# EAGLE schematic CFT-PB2 (EAGLE 5.11)
DRAWN_BY: Alexios; PROJECT_NAME: CFT Mini-Computer; REVISION: Rev B; SHEET_DESCRIPTION: Address Register, Address Bus Drivers & Termination, Autoindex Logic, Device Decoder; SIMULATION_FILENAME: addressing.v; URL: http://www.bedroomlan.org/cft

## Sheet 1 of 6
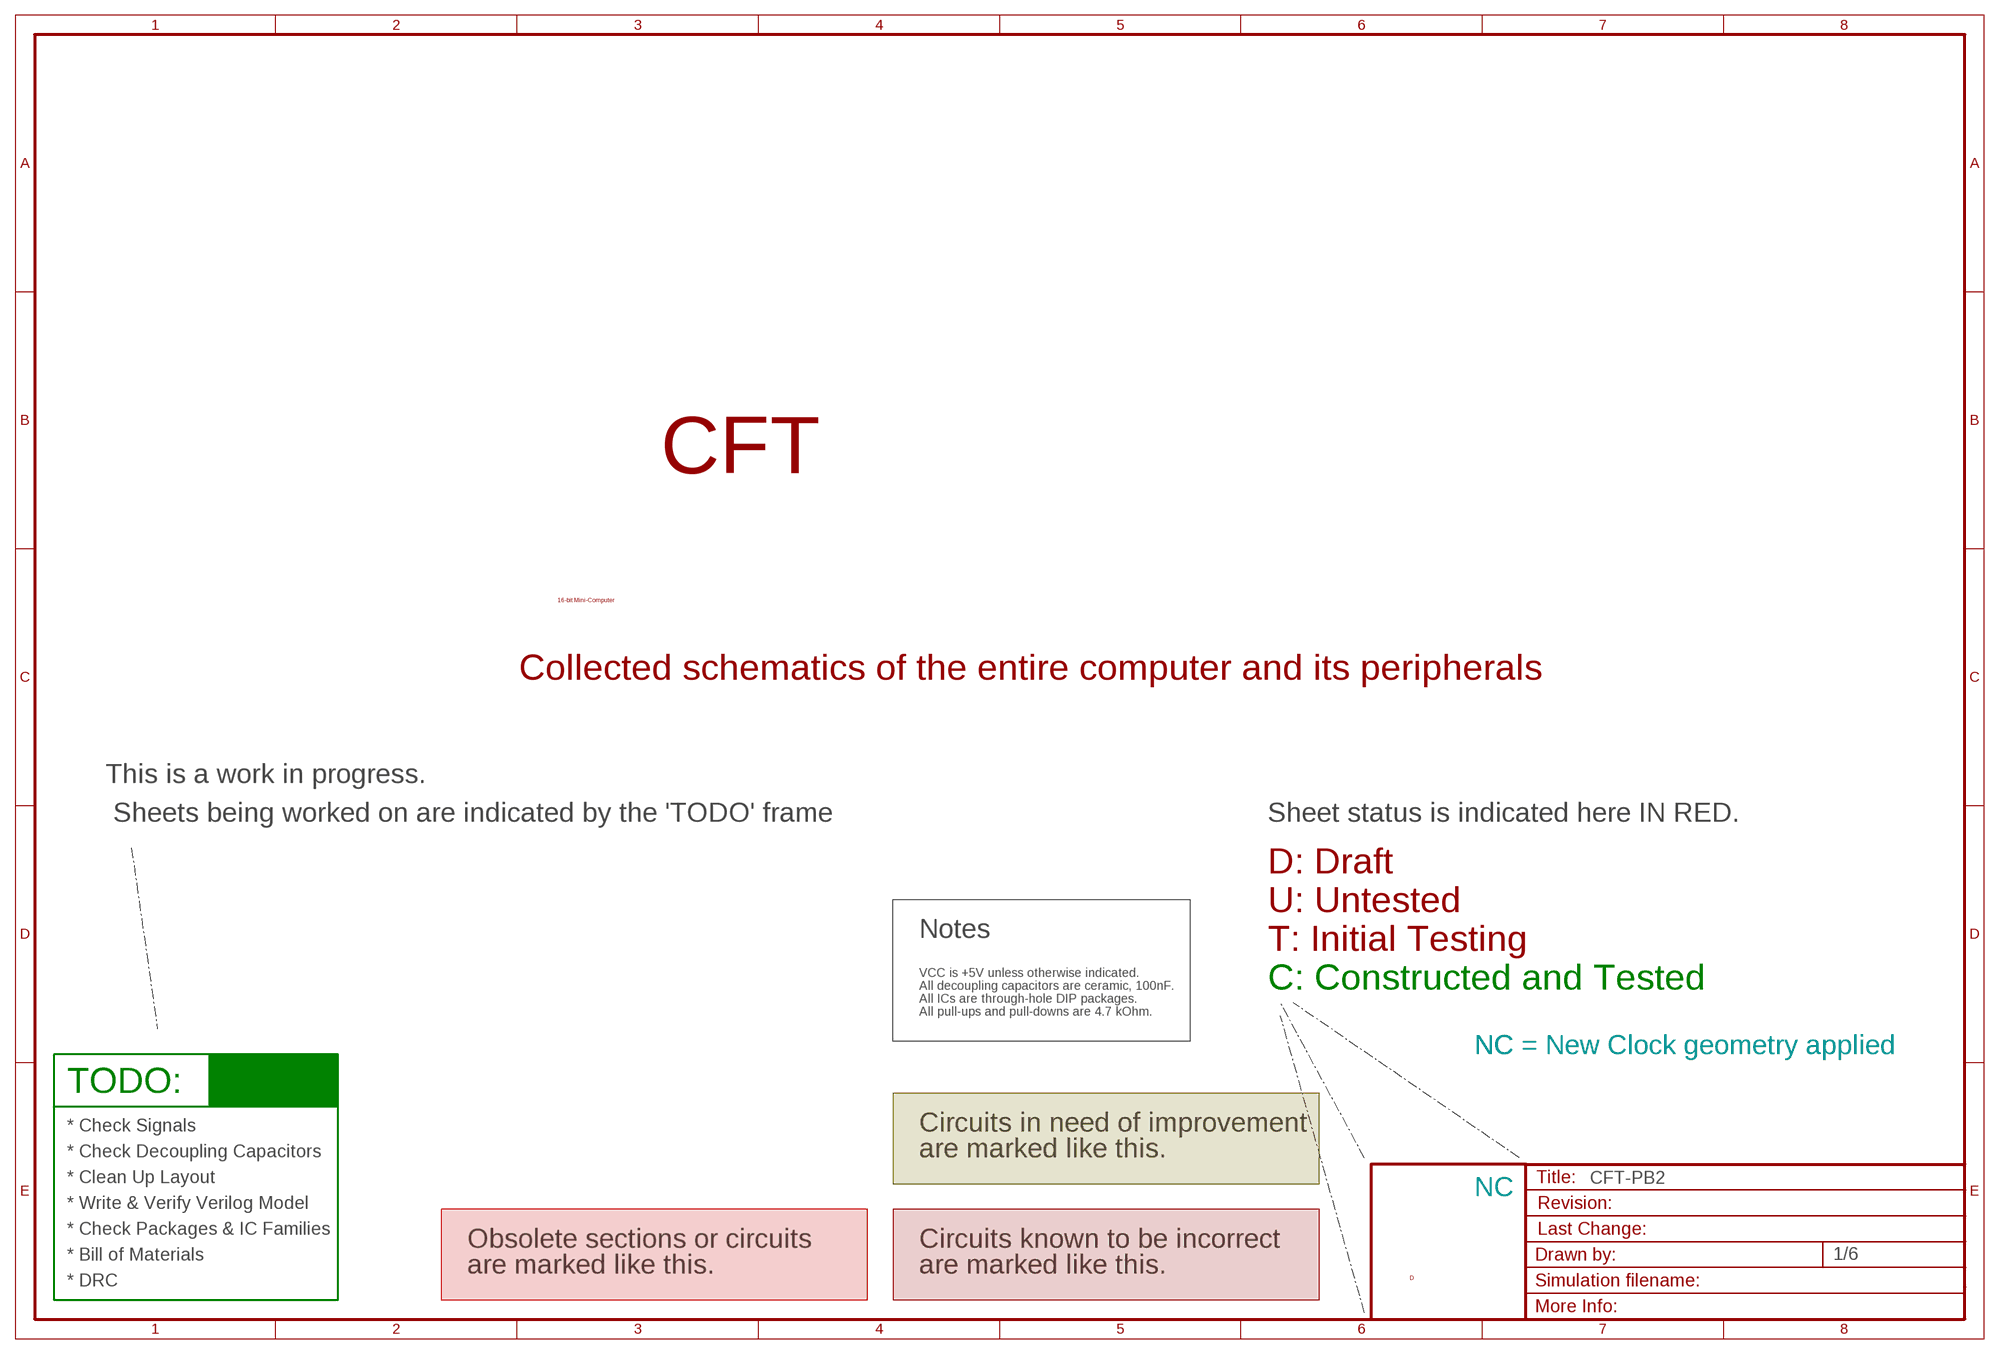
[diagram p0: schematic, sheet 1]

### Notes on the sheet
- CFT
- 16-bit Mini-Computer
- Collected schematics of the entire computer and its peripherals
- This is a work in progress.
- Sheets being worked on are indicated by the 'TODO' frame | Sheet status is indicated here IN RED.
- D: Draft
- U: Untested
- Notes
- T: Initial Testing
- VCC is +5V unless otherwise indicated.
- All decoupling capacitors are ceramic, 100nF. | C: Constructed and Tested
- All ICs are through-hole DIP packages.
- All pull-ups and pull-downs are 4.7 kOhm.
- NC | NC = New Clock geometry applied
- TODO:
- * Check Signals | Circuits in need of improvement
- * Check Decoupling Capacitors | are marked like this.
- * Clean Up Layout
- NC
- * Write & Verify Verilog Model
- * Check Packages & IC Families
- Obsolete sections or circuits | Circuits known to be incorrect
- * Bill of Materials
- are marked like this. | are marked like this.
- D
- * DRC

## Sheet 2 of 6
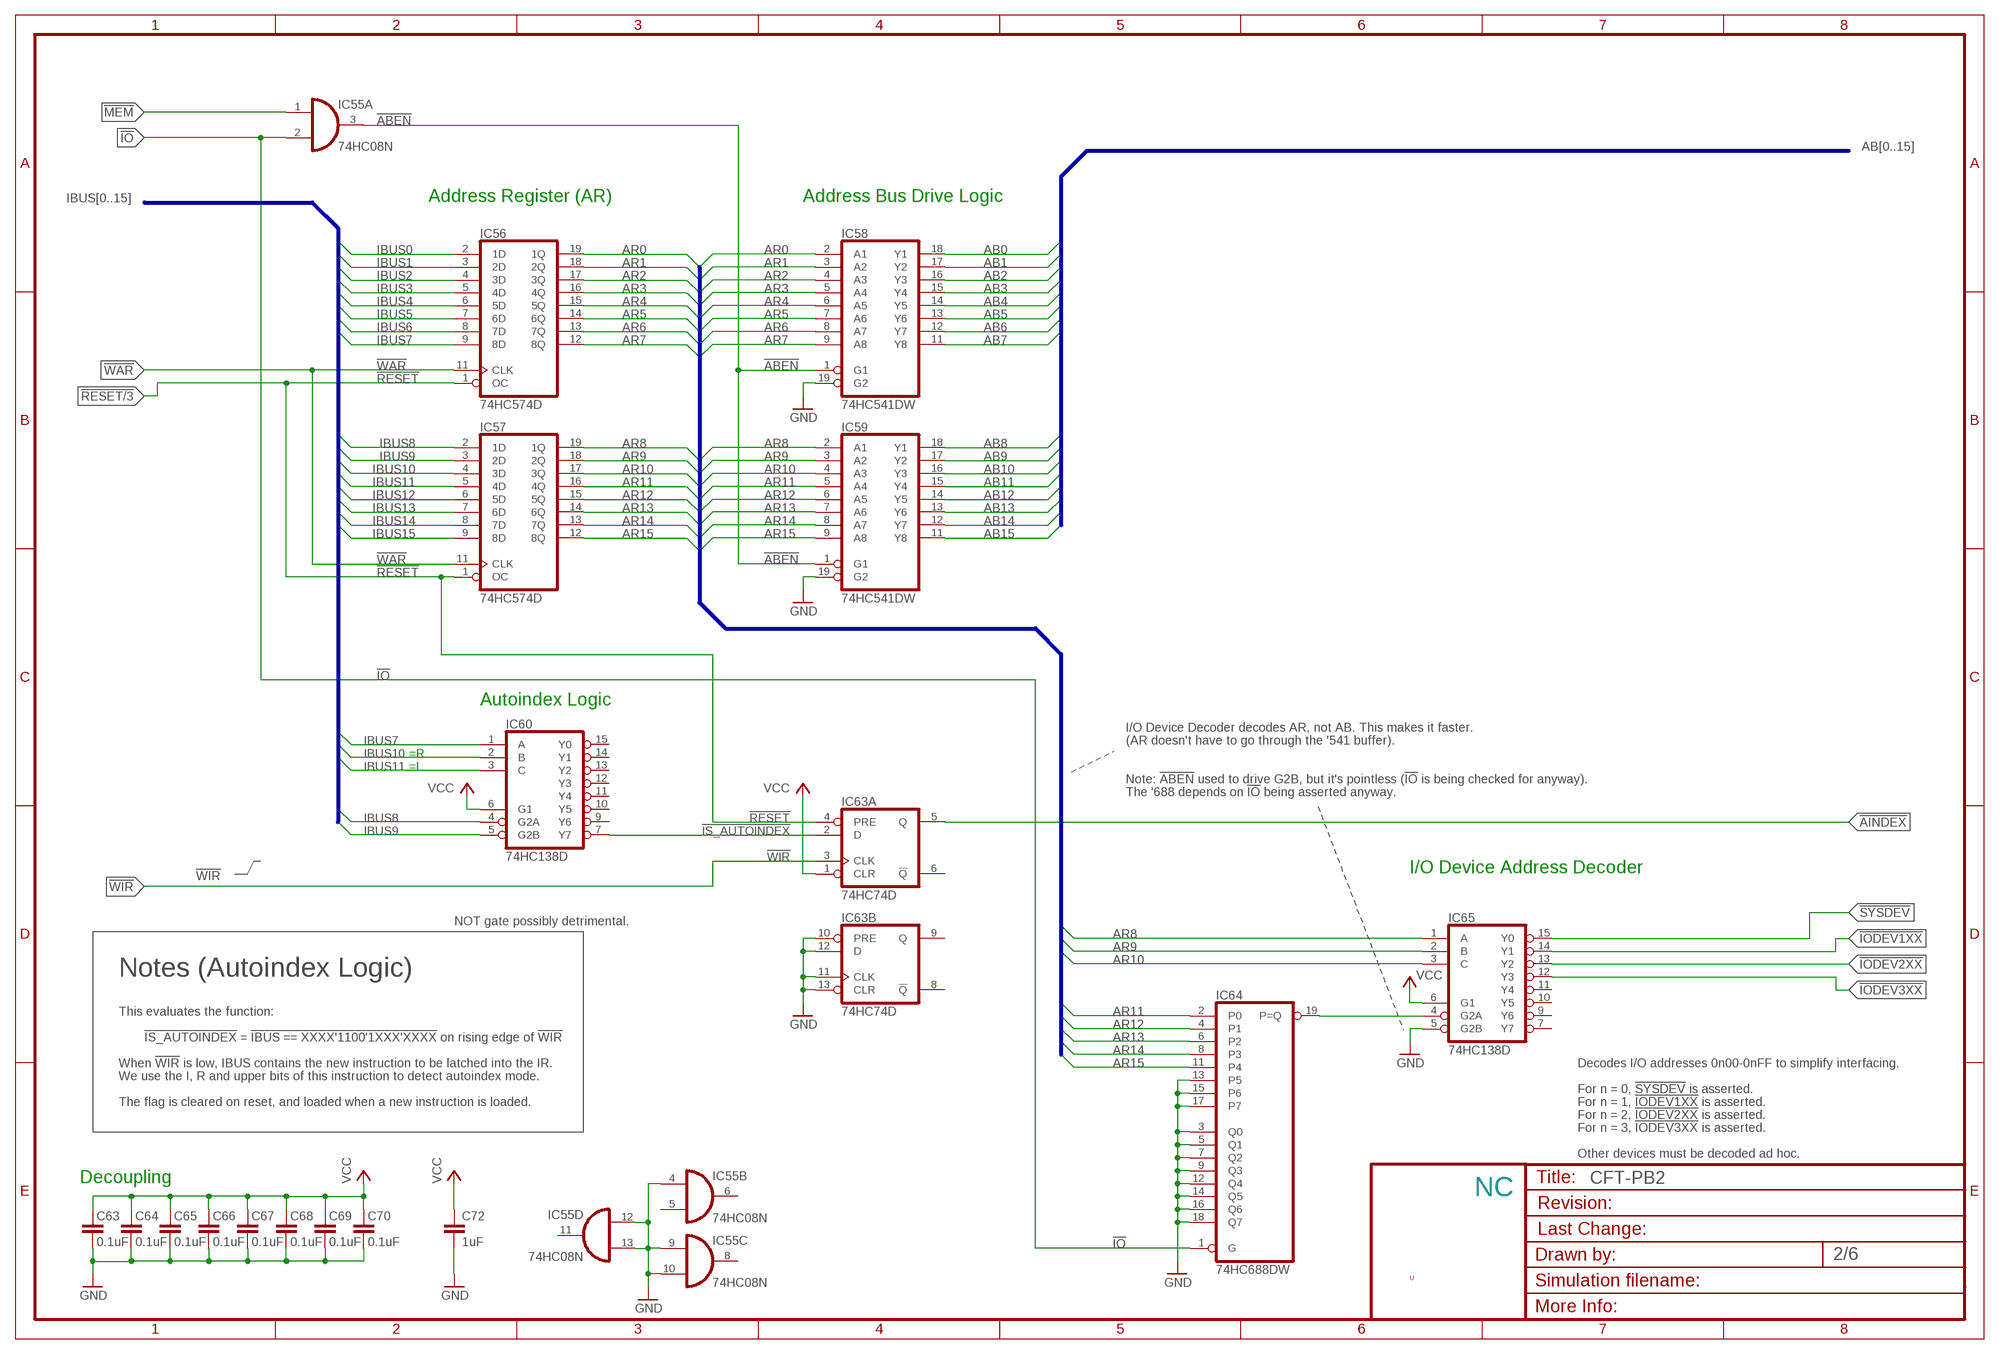
[diagram p1: schematic, sheet 2]

### Parts
C63  0.1uF  C-EUC0805K  [C0805K]
C64  0.1uF  C-EUC0805K  [C0805K]
C65  0.1uF  C-EUC0805K  [C0805K]
C66  0.1uF  C-EUC0805K  [C0805K]
C67  0.1uF  C-EUC0805K  [C0805K]
C68  0.1uF  C-EUC0805K  [C0805K]
C69  0.1uF  C-EUC0805K  [C0805K]
C70  0.1uF  C-EUC0805K  [C0805K]
C72  1uF  C-EUC0805K  [C0805K]
IC55  74HC08N  [DIL14]
IC56  74HC574D  [SO20W]
IC57  74HC574D  [SO20W]
IC58  74HC541DW  [SO20W]
IC59  74HC541DW  [SO20W]
IC60  74HC138D  [SO16]
IC63  74HC74D  [SO14]
IC64  74HC688DW  [SO20W]
IC65  74HC138D  [SO16]

### Nets
!ABEN: IC55.3(A:O) IC58.1(G1) IC59.1(G1)
!AINDEX: IC63.5(A:Q) ; also sheet 6
!IO: IC55.2(A:I1) IC64.1(G) ; also sheet 6
!IODEV1XX: IC65.14(Y1) ; also sheet 6
!IODEV2XX: IC65.13(Y2) ; also sheet 6
!IODEV3XX: IC65.12(Y3) ; also sheet 6
!IS_AUTOINDEX: IC60.7(Y7) IC63.2(A:D)
!MEM: IC55.1(A:I0) ; also sheet 6
!RESET: IC56.1(OC) IC57.1(OC) IC63.4(A:PRE) ; also sheet 3,6
!SYSDEV: IC65.15(Y0) ; also sheet 6
!WAR: IC56.11(CLK) IC57.11(CLK) ; also sheet 6
!WIR: IC63.3(A:CLK) ; also sheet 6
AB0: IC58.18(Y1) ; also sheet 6
AB1: IC58.17(Y2) ; also sheet 6
AB2: IC58.16(Y3) ; also sheet 6
AB3: IC58.15(Y4) ; also sheet 6
AB4: IC58.14(Y5) ; also sheet 6
AB5: IC58.13(Y6) ; also sheet 6
AB6: IC58.12(Y7) ; also sheet 6
AB7: IC58.11(Y8) ; also sheet 6
AB8: IC59.18(Y1) ; also sheet 6
AB9: IC59.17(Y2) ; also sheet 6
AB10: IC59.16(Y3) ; also sheet 6
AB11: IC59.15(Y4) ; also sheet 6
AB12: IC59.14(Y5) ; also sheet 6
AB13: IC59.13(Y6) ; also sheet 6
AB14: IC59.12(Y7) ; also sheet 6
AB15: IC59.11(Y8) ; also sheet 6
AR0: IC56.19(1Q) IC58.2(A1)
AR1: IC56.18(2Q) IC58.3(A2)
AR2: IC56.17(3Q) IC58.4(A3)
AR3: IC56.16(4Q) IC58.5(A4)
AR4: IC56.15(5Q) IC58.6(A5)
AR5: IC56.14(6Q) IC58.7(A6)
AR6: IC56.13(7Q) IC58.8(A7)
AR7: IC56.12(8Q) IC58.9(A8)
AR8: IC57.19(1Q) IC59.2(A1) IC65.1(A)
AR9: IC57.18(2Q) IC59.3(A2) IC65.2(B)
AR10: IC57.17(3Q) IC59.4(A3) IC65.3(C)
AR11: IC57.16(4Q) IC59.5(A4) IC64.2(P0)
AR12: IC57.15(5Q) IC59.6(A5) IC64.4(P1)
AR13: IC57.14(6Q) IC59.7(A6) IC64.6(P2)
AR14: IC57.13(7Q) IC59.8(A7) IC64.8(P3)
AR15: IC57.12(8Q) IC59.9(A8) IC64.11(P4)
GND [low power]: C63.1 C64.1 C65.1 C66.1 C67.1 C68.1 C69.1 C70.1 C72.2 IC55.4(B:I0) IC55.9(C:I0) IC55.10(C:I1) IC55.12(D:I0) IC55.13(D:I1) IC58.19(G2) IC59.19(G2) IC63.10(B:PRE) IC63.11(B:CLK) IC63.12(B:D) IC63.13(B:CLR) IC64.3(Q0) IC64.5(Q1) IC64.7(Q2) IC64.9(Q3) IC64.12(Q4) IC64.13(P5) IC64.14(Q5) IC64.15(P6) IC64.16(Q6) IC64.17(P7) IC64.18(Q7) IC65.5(G2B) ; also sheet 3,4,5,6
IBUS0: IC56.2(1D) ; also sheet 3,4,5,6
IBUS1: IC56.3(2D) ; also sheet 3,4,5,6
IBUS2: IC56.4(3D) ; also sheet 3,4,5,6
IBUS3: IC56.5(4D) ; also sheet 3,4,5,6
IBUS4: IC56.6(5D) ; also sheet 3,4,5,6
IBUS5: IC56.7(6D) ; also sheet 3,4,5,6
IBUS6: IC56.8(7D) ; also sheet 3,4,5,6
IBUS7: IC56.9(8D) IC60.1(A) ; also sheet 3,4,5,6
IBUS8: IC57.2(1D) IC60.4(G2A) ; also sheet 3,4,5,6
IBUS9: IC57.3(2D) IC60.5(G2B) ; also sheet 3,4,5,6
IBUS10: IC57.4(3D) IC60.2(B) ; also sheet 3,4,5,6
IBUS11: IC57.5(4D) IC60.3(C) ; also sheet 3,4,5,6
IBUS12: IC57.6(5D) ; also sheet 3,4,5,6
IBUS13: IC57.7(6D) ; also sheet 3,4,5,6
IBUS14: IC57.8(7D) ; also sheet 3,4,5,6
IBUS15: IC57.9(8D) ; also sheet 3,4,5,6
N$95: IC64.19(P=Q) IC65.4(G2A)
VCC [low power]: C63.2 C64.2 C65.2 C66.2 C67.2 C68.2 C69.2 C70.2 C72.1 IC60.6(G1) IC63.1(A:CLR) IC65.6(G1) ; also sheet 3,4,5,6
Unconnected: IC55.5(B:I1) IC55.6(B:O) IC55.8(C:O) IC55.11(D:O) IC60.9(Y6) IC60.10(Y5) IC60.11(Y4) IC60.12(Y3) IC60.13(Y2) IC60.14(Y1) IC60.15(Y0) IC63.6(A:!Q) IC63.8(B:!Q) IC63.9(B:Q) IC65.7(Y7) IC65.9(Y6) IC65.10(Y5) IC65.11(Y4)

### Buses
AR[0..15]
IBUS[0..15]
AB[0..15]

### Notes on the sheet
- Address Register (AR) | Address Bus Drive Logic
- Autoindex Logic
- I/O Device Decoder decodes AR, not AB. This makes it faster.
- (AR doesn't have to go through the '541 buffer).
- =R
- =I
- Note: !ABEN! used to drive G2B, but it's pointless (!IO! is being checked for anyway).
- The '688 depends on !IO! being asserted anyway.
- I/O Device Address Decoder
- NOT gate possibly detrimental.
- Notes (Autoindex Logic)
- This evaluates the function:
- !IS_AUTOINDEX! = !IBUS == XXXX'1100'1XXX'XXXX! on rising edge of !WIR!
- When !WIR! is low, IBUS contains the new instruction to be latched into the IR. | Decodes I/O addresses 0n00-0nFF to simplify interfacing.
- We use the I, R and upper bits of this instruction to detect autoindex mode.
- For n = 0, !SYSDEV! is asserted.
- The flag is cleared on reset, and loaded when a new instruction is loaded. | For n = 1, !IODEV1XX! is asserted.
- For n = 2, !IODEV2XX! is asserted.
- For n = 3, !IODEV3XX! is asserted.
- Other devices must be decoded ad hoc.
- Decoupling
- NC
- U

## Sheet 3 of 6
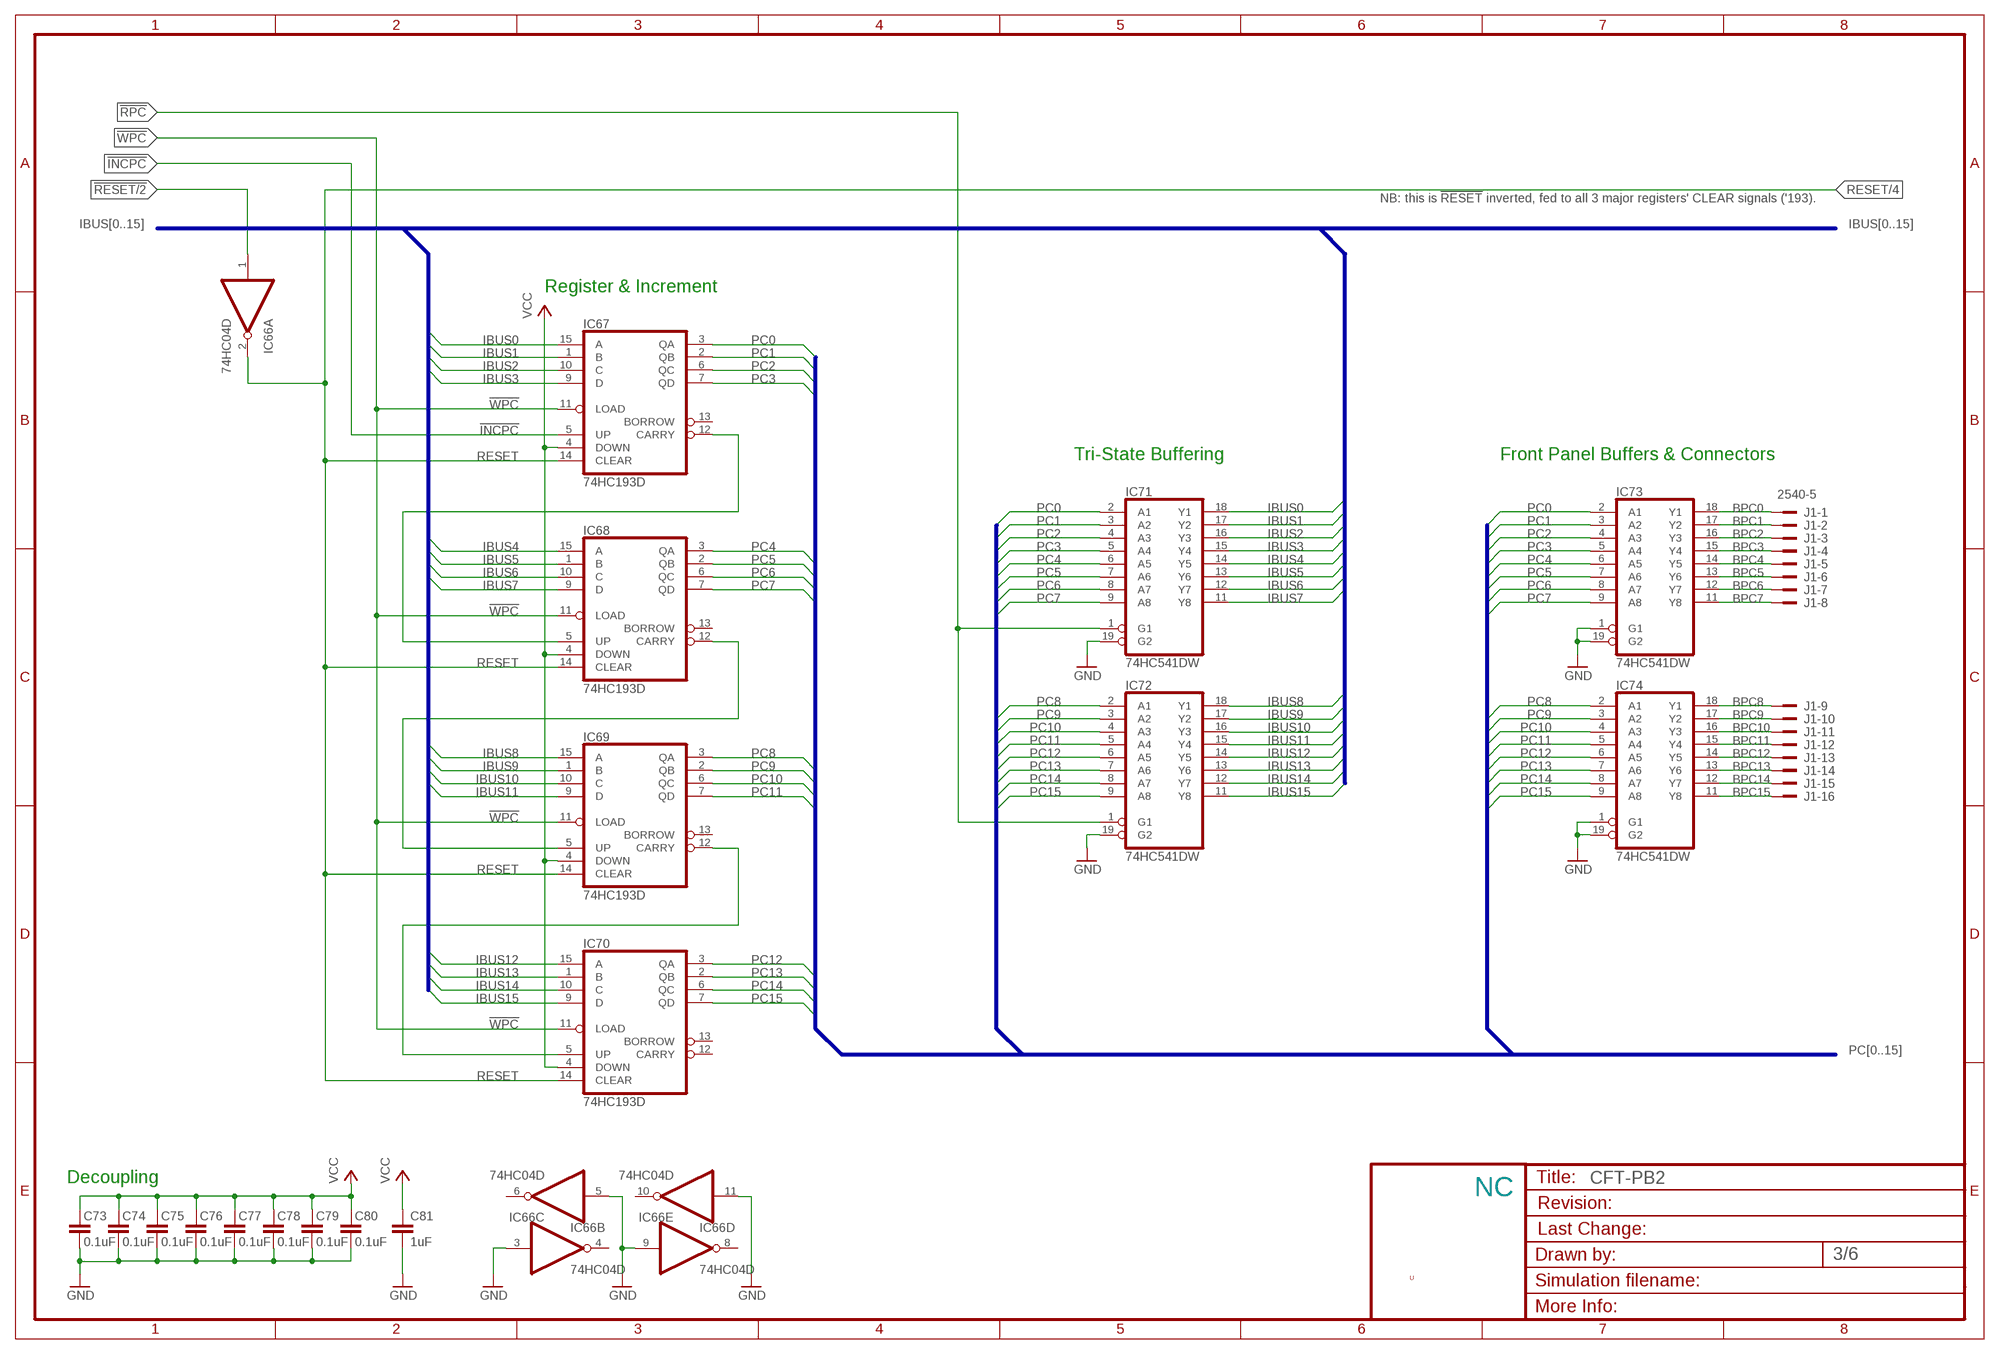
[diagram p2: schematic, sheet 3]

### Parts
C73  0.1uF  C-EUC0805K  [C0805K]
C74  0.1uF  C-EUC0805K  [C0805K]
C75  0.1uF  C-EUC0805K  [C0805K]
C76  0.1uF  C-EUC0805K  [C0805K]
C77  0.1uF  C-EUC0805K  [C0805K]
C78  0.1uF  C-EUC0805K  [C0805K]
C79  0.1uF  C-EUC0805K  [C0805K]
C80  0.1uF  C-EU025-024X044  [C025-024X044]
C81  1uF  C-EU025-024X044  [C025-024X044]
IC66  74HC04D  [SO14]
IC67  74HC193D  [SO16D]
IC68  74HC193D  [SO16D]
IC69  74HC193D  [SO16D]
IC70  74HC193D  [SO16D]
IC71  74HC541DW  [SO20W]
IC72  74HC541DW  [SO20W]
IC73  74HC541DW  [SO20W]
IC74  74HC541DW  [SO20W]
J1  2540-5  [PAK100/2500-5-40]

### Nets
!INCPC: IC67.5(UP) ; also sheet 6
!RESET: IC66.1(A:I) ; also sheet 2,6
!RPC: IC71.1(G1) IC72.1(G1) ; also sheet 6
!WPC: IC67.11(LOAD) IC68.11(LOAD) IC69.11(LOAD) IC70.11(LOAD) ; also sheet 6
BPC0: IC73.18(Y1) J1.1
BPC1: IC73.17(Y2) J1.2
BPC2: IC73.16(Y3) J1.3
BPC3: IC73.15(Y4) J1.4
BPC4: IC73.14(Y5) J1.5
BPC5: IC73.13(Y6) J1.6
BPC6: IC73.12(Y7) J1.7
BPC7: IC73.11(Y8) J1.8
BPC8: IC74.18(Y1) J1.9
BPC9: IC74.17(Y2) J1.10
BPC10: IC74.16(Y3) J1.11
BPC11: IC74.15(Y4) J1.12
BPC12: IC74.14(Y5) J1.13
BPC13: IC74.13(Y6) J1.14
BPC14: IC74.12(Y7) J1.15
BPC15: IC74.11(Y8) J1.16
GND [low power]: C73.1 C74.1 C75.1 C76.1 C77.1 C78.1 C79.1 C80.1 C81.2 IC66.3(B:I) IC66.5(C:I) IC66.9(D:I) IC66.11(E:I) IC71.19(G2) IC72.19(G2) IC73.1(G1) IC73.19(G2) IC74.1(G1) IC74.19(G2) ; also sheet 2,4,5,6
IBUS0: IC67.15(A) IC71.18(Y1) ; also sheet 2,4,5,6
IBUS1: IC67.1(B) IC71.17(Y2) ; also sheet 2,4,5,6
IBUS2: IC67.10(C) IC71.16(Y3) ; also sheet 2,4,5,6
IBUS3: IC67.9(D) IC71.15(Y4) ; also sheet 2,4,5,6
IBUS4: IC68.15(A) IC71.14(Y5) ; also sheet 2,4,5,6
IBUS5: IC68.1(B) IC71.13(Y6) ; also sheet 2,4,5,6
IBUS6: IC68.10(C) IC71.12(Y7) ; also sheet 2,4,5,6
IBUS7: IC68.9(D) IC71.11(Y8) ; also sheet 2,4,5,6
IBUS8: IC69.15(A) IC72.18(Y1) ; also sheet 2,4,5,6
IBUS9: IC69.1(B) IC72.17(Y2) ; also sheet 2,4,5,6
IBUS10: IC69.10(C) IC72.16(Y3) ; also sheet 2,4,5,6
IBUS11: IC69.9(D) IC72.15(Y4) ; also sheet 2,4,5,6
IBUS12: IC70.15(A) IC72.14(Y5) ; also sheet 2,4,5,6
IBUS13: IC70.1(B) IC72.13(Y6) ; also sheet 2,4,5,6
IBUS14: IC70.10(C) IC72.12(Y7) ; also sheet 2,4,5,6
IBUS15: IC70.9(D) IC72.11(Y8) ; also sheet 2,4,5,6
N$70: IC67.12(CARRY) IC68.5(UP)
N$71: IC68.12(CARRY) IC69.5(UP)
N$734: IC69.12(CARRY) IC70.5(UP)
PC0: IC67.3(QA) IC71.2(A1) IC73.2(A1)
PC1: IC67.2(QB) IC71.3(A2) IC73.3(A2)
PC2: IC67.6(QC) IC71.4(A3) IC73.4(A3)
PC3: IC67.7(QD) IC71.5(A4) IC73.5(A4)
PC4: IC68.3(QA) IC71.6(A5) IC73.6(A5)
PC5: IC68.2(QB) IC71.7(A6) IC73.7(A6)
PC6: IC68.6(QC) IC71.8(A7) IC73.8(A7)
PC7: IC68.7(QD) IC71.9(A8) IC73.9(A8)
PC8: IC69.3(QA) IC72.2(A1) IC74.2(A1)
PC9: IC69.2(QB) IC72.3(A2) IC74.3(A2)
PC10: IC69.6(QC) IC72.4(A3) IC74.4(A3) ; also sheet 6
PC11: IC69.7(QD) IC72.5(A4) IC74.5(A4) ; also sheet 6
PC12: IC70.3(QA) IC72.6(A5) IC74.6(A5) ; also sheet 6
PC13: IC70.2(QB) IC72.7(A6) IC74.7(A6) ; also sheet 6
PC14: IC70.6(QC) IC72.8(A7) IC74.8(A7) ; also sheet 6
PC15: IC70.7(QD) IC72.9(A8) IC74.9(A8) ; also sheet 6
RESET: IC66.2(A:O) IC67.14(CLEAR) IC68.14(CLEAR) IC69.14(CLEAR) IC70.14(CLEAR) ; also sheet 4,5
VCC [low power]: C73.2 C74.2 C75.2 C76.2 C77.2 C78.2 C79.2 C80.2 C81.1 IC67.4(DOWN) IC68.4(DOWN) IC69.4(DOWN) IC70.4(DOWN) ; also sheet 2,4,5,6
Unconnected: IC66.4(B:O) IC66.6(C:O) IC66.8(D:O) IC66.10(E:O) IC67.13(BORROW) IC68.13(BORROW) IC69.13(BORROW) IC70.12(CARRY) IC70.13(BORROW)

### Buses
IBUS[0..15]
PC[0..15]

### Notes on the sheet
- NB: this is !RESET! inverted, fed to all 3 major registers' CLEAR signals ('193).
- Register & Increment
- Tri-State Buffering | Front Panel Buffers & Connectors
- Decoupling
- NC
- U

## Sheet 4 of 6
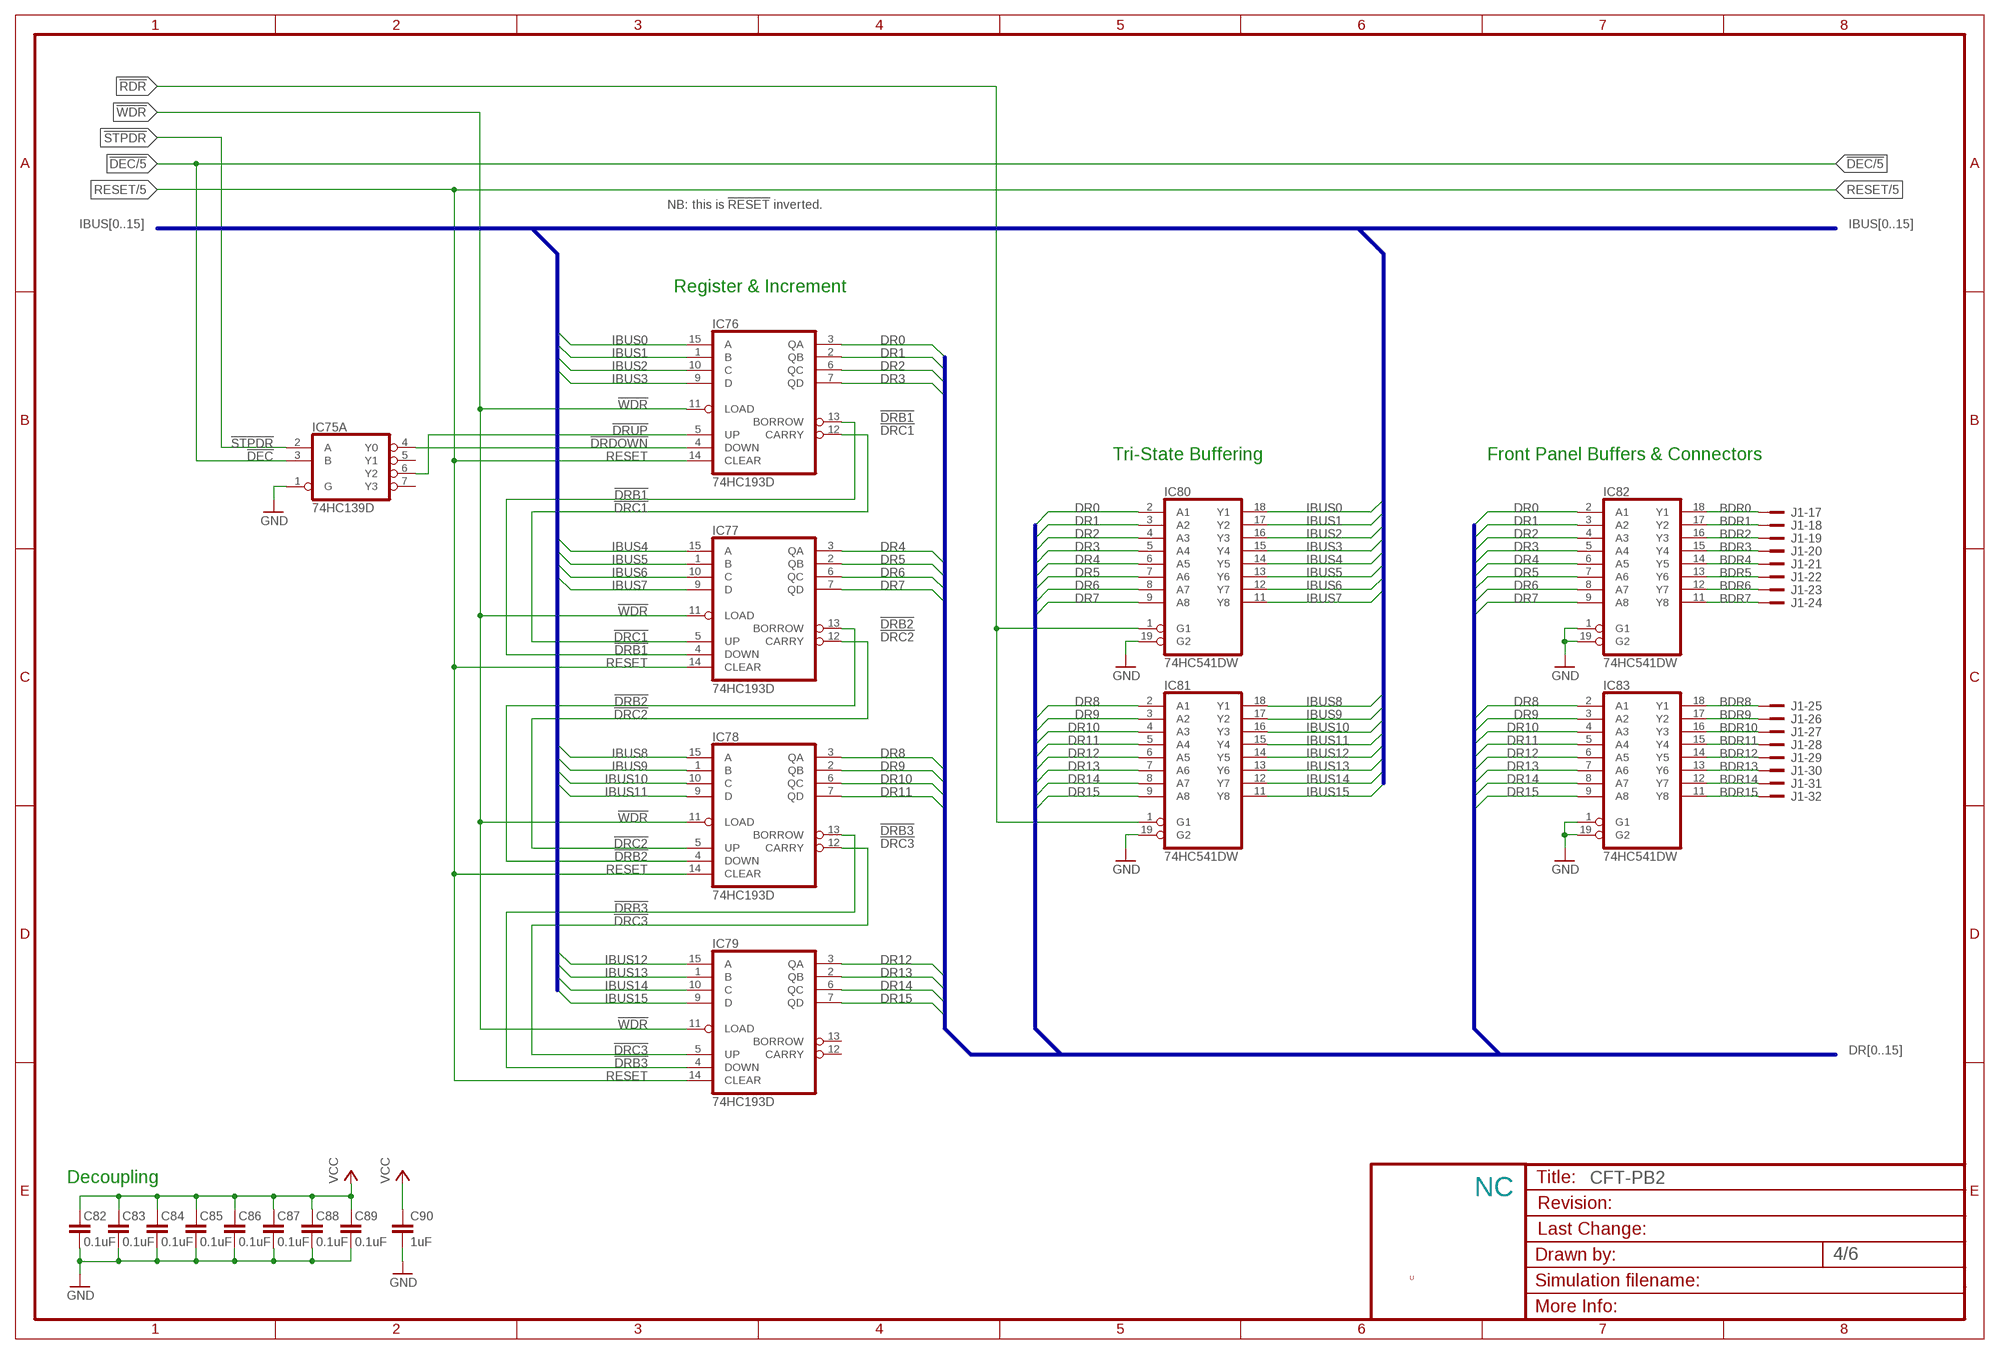
[diagram p3: schematic, sheet 4]

### Parts
C82  0.1uF  C-EU025-024X044  [C025-024X044]
C83  0.1uF  C-EU025-024X044  [C025-024X044]
C84  0.1uF  C-EU025-024X044  [C025-024X044]
C85  0.1uF  C-EU025-024X044  [C025-024X044]
C86  0.1uF  C-EU025-024X044  [C025-024X044]
C87  0.1uF  C-EU025-024X044  [C025-024X044]
C88  0.1uF  C-EU025-024X044  [C025-024X044]
C89  0.1uF  C-EU025-024X044  [C025-024X044]
C90  1uF  C-EU025-024X044  [C025-024X044]
IC75  74HC139D  [SO16]
IC76  74HC193D  [SO16D]
IC77  74HC193D  [SO16D]
IC78  74HC193D  [SO16D]
IC79  74HC193D  [SO16D]
IC80  74HC541DW  [SO20W]
IC81  74HC541DW  [SO20W]
IC82  74HC541DW  [SO20W]
IC83  74HC541DW  [SO20W]

### Nets
!DEC: IC75.3(A:B) ; also sheet 5,6
!DRB1: IC76.13(BORROW) IC77.4(DOWN)
!DRB2: IC77.13(BORROW) IC78.4(DOWN)
!DRB3: IC78.13(BORROW) IC79.4(DOWN)
!DRC1: IC76.12(CARRY) IC77.5(UP)
!DRC2: IC77.12(CARRY) IC78.5(UP)
!DRC3: IC78.12(CARRY) IC79.5(UP)
!DRDOWN: IC75.4(A:Y0) IC76.4(DOWN)
!DRUP: IC75.6(A:Y2) IC76.5(UP)
!RDR: IC80.1(G1) IC81.1(G1) ; also sheet 6
!STPDR: IC75.2(A:A) ; also sheet 6
!WDR: IC76.11(LOAD) IC77.11(LOAD) IC78.11(LOAD) IC79.11(LOAD) ; also sheet 6
BDR0: IC82.18(Y1) J1.17
BDR1: IC82.17(Y2) J1.18
BDR2: IC82.16(Y3) J1.19
BDR3: IC82.15(Y4) J1.20
BDR4: IC82.14(Y5) J1.21
BDR5: IC82.13(Y6) J1.22
BDR6: IC82.12(Y7) J1.23
BDR7: IC82.11(Y8) J1.24
BDR8: IC83.18(Y1) J1.25
BDR9: IC83.17(Y2) J1.26
BDR10: IC83.16(Y3) J1.27
BDR11: IC83.15(Y4) J1.28
BDR12: IC83.14(Y5) J1.29
BDR13: IC83.13(Y6) J1.30
BDR14: IC83.12(Y7) J1.31
BDR15: IC83.11(Y8) J1.32
DR0: IC76.3(QA) IC80.2(A1) IC82.2(A1)
DR1: IC76.2(QB) IC80.3(A2) IC82.3(A2)
DR2: IC76.6(QC) IC80.4(A3) IC82.4(A3)
DR3: IC76.7(QD) IC80.5(A4) IC82.5(A4)
DR4: IC77.3(QA) IC80.6(A5) IC82.6(A5)
DR5: IC77.2(QB) IC80.7(A6) IC82.7(A6)
DR6: IC77.6(QC) IC80.8(A7) IC82.8(A7)
DR7: IC77.7(QD) IC80.9(A8) IC82.9(A8)
DR8: IC78.3(QA) IC81.2(A1) IC83.2(A1)
DR9: IC78.2(QB) IC81.3(A2) IC83.3(A2)
DR10: IC78.6(QC) IC81.4(A3) IC83.4(A3)
DR11: IC78.7(QD) IC81.5(A4) IC83.5(A4)
DR12: IC79.3(QA) IC81.6(A5) IC83.6(A5)
DR13: IC79.2(QB) IC81.7(A6) IC83.7(A6)
DR14: IC79.6(QC) IC81.8(A7) IC83.8(A7)
DR15: IC79.7(QD) IC81.9(A8) IC83.9(A8)
GND [low power]: C82.1 C83.1 C84.1 C85.1 C86.1 C87.1 C88.1 C89.1 C90.2 IC75.1(A:G) IC80.19(G2) IC81.19(G2) IC82.1(G1) IC82.19(G2) IC83.1(G1) IC83.19(G2) ; also sheet 2,3,5,6
IBUS0: IC76.15(A) IC80.18(Y1) ; also sheet 2,3,5,6
IBUS1: IC76.1(B) IC80.17(Y2) ; also sheet 2,3,5,6
IBUS2: IC76.10(C) IC80.16(Y3) ; also sheet 2,3,5,6
IBUS3: IC76.9(D) IC80.15(Y4) ; also sheet 2,3,5,6
IBUS4: IC77.15(A) IC80.14(Y5) ; also sheet 2,3,5,6
IBUS5: IC77.1(B) IC80.13(Y6) ; also sheet 2,3,5,6
IBUS6: IC77.10(C) IC80.12(Y7) ; also sheet 2,3,5,6
IBUS7: IC77.9(D) IC80.11(Y8) ; also sheet 2,3,5,6
IBUS8: IC78.15(A) IC81.18(Y1) ; also sheet 2,3,5,6
IBUS9: IC78.1(B) IC81.17(Y2) ; also sheet 2,3,5,6
IBUS10: IC78.10(C) IC81.16(Y3) ; also sheet 2,3,5,6
IBUS11: IC78.9(D) IC81.15(Y4) ; also sheet 2,3,5,6
IBUS12: IC79.15(A) IC81.14(Y5) ; also sheet 2,3,5,6
IBUS13: IC79.1(B) IC81.13(Y6) ; also sheet 2,3,5,6
IBUS14: IC79.10(C) IC81.12(Y7) ; also sheet 2,3,5,6
IBUS15: IC79.9(D) IC81.11(Y8) ; also sheet 2,3,5,6
RESET: IC76.14(CLEAR) IC77.14(CLEAR) IC78.14(CLEAR) IC79.14(CLEAR) ; also sheet 3,5
VCC [low power]: C82.2 C83.2 C84.2 C85.2 C86.2 C87.2 C88.2 C89.2 C90.1 ; also sheet 2,3,5,6
Unconnected: IC75.5(A:Y1) IC75.7(A:Y3) IC79.12(CARRY) IC79.13(BORROW)

### Buses
IBUS[0..15]
DR[0..15]

### Notes on the sheet
- NB: this is !RESET! inverted.
- Register & Increment
- Tri-State Buffering | Front Panel Buffers & Connectors
- Decoupling
- NC
- U

## Sheet 5 of 6
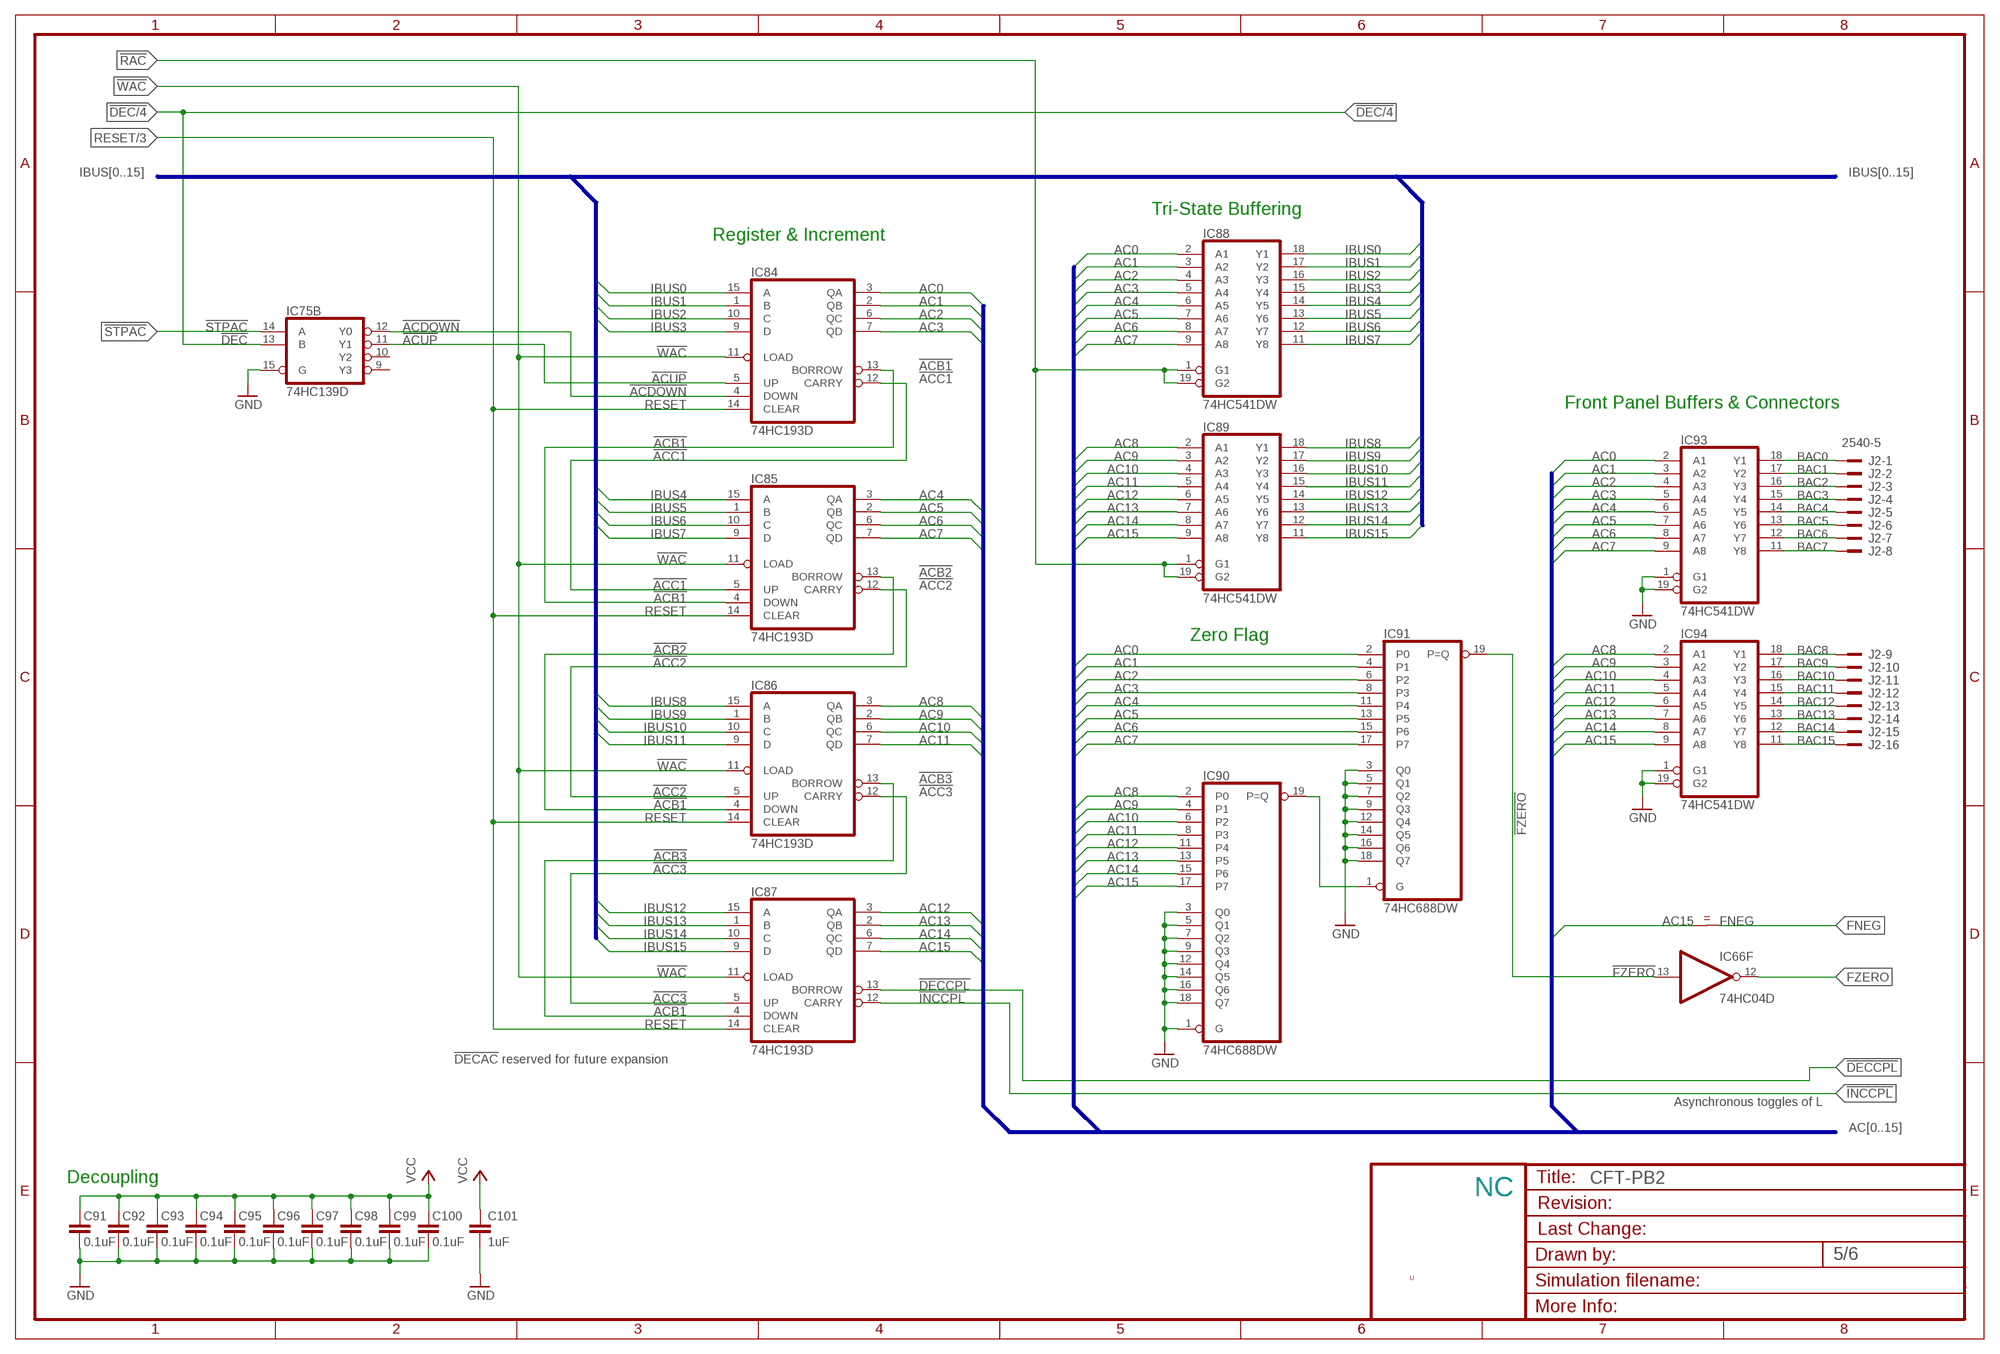
[diagram p4: schematic, sheet 5]

### Parts
C91  0.1uF  C-EU025-024X044  [C025-024X044]
C92  0.1uF  C-EU025-024X044  [C025-024X044]
C93  0.1uF  C-EU025-024X044  [C025-024X044]
C94  0.1uF  C-EU025-024X044  [C025-024X044]
C95  0.1uF  C-EU025-024X044  [C025-024X044]
C96  0.1uF  C-EU025-024X044  [C025-024X044]
C97  0.1uF  C-EU025-024X044  [C025-024X044]
C98  0.1uF  C-EU025-024X044  [C025-024X044]
C99  0.1uF  C-EU025-024X044  [C025-024X044]
C100  0.1uF  C-EU025-024X044  [C025-024X044]
C101  1uF  C-EU025-024X044  [C025-024X044]
IC84  74HC193D  [SO16D]
IC85  74HC193D  [SO16D]
IC86  74HC193D  [SO16D]
IC87  74HC193D  [SO16D]
IC88  74HC541DW  [SO20W]
IC89  74HC541DW  [SO20W]
IC90  74HC688DW  [SO20W]
IC91  74HC688DW  [SO20W]
IC93  74HC541DW  [SO20W]
IC94  74HC541DW  [SO20W]
J2  2540-5  [PAK100/2500-5-40]
X1  SIGNAL-RENAME  [SIGNAL-RENAME]

### Nets
!ACB1: IC84.13(BORROW) IC85.4(DOWN)
!ACB2: IC85.13(BORROW) IC86.4(DOWN)
!ACB3: IC86.13(BORROW) IC87.4(DOWN)
!ACC1: IC84.12(CARRY) IC85.5(UP)
!ACC2: IC85.12(CARRY) IC86.5(UP)
!ACC3: IC86.12(CARRY) IC87.5(UP)
!ACDOWN: IC75.12(B:Y0) IC84.4(DOWN)
!ACUP: IC75.11(B:Y1) IC84.5(UP)
!DEC: IC75.13(B:B) ; also sheet 4,6
!DECCPL: IC87.13(BORROW) ; also sheet 6
!FZERO: IC66.13(F:I) IC91.19(P=Q)
!INCCPL: IC87.12(CARRY) ; also sheet 6
!RAC: IC88.1(G1) IC88.19(G2) IC89.1(G1) IC89.19(G2) ; also sheet 6
!STPAC: IC75.14(B:A) ; also sheet 6
!WAC: IC84.11(LOAD) IC85.11(LOAD) IC86.11(LOAD) IC87.11(LOAD) ; also sheet 6
AC0: IC84.3(QA) IC88.2(A1) IC91.2(P0) IC93.2(A1) ; also sheet 6
AC1: IC84.2(QB) IC88.3(A2) IC91.4(P1) IC93.3(A2) ; also sheet 6
AC2: IC84.6(QC) IC88.4(A3) IC91.6(P2) IC93.4(A3) ; also sheet 6
AC3: IC84.7(QD) IC88.5(A4) IC91.8(P3) IC93.5(A4) ; also sheet 6
AC4: IC85.3(QA) IC88.6(A5) IC91.11(P4) IC93.6(A5) ; also sheet 6
AC5: IC85.2(QB) IC88.7(A6) IC91.13(P5) IC93.7(A6) ; also sheet 6
AC6: IC85.6(QC) IC88.8(A7) IC91.15(P6) IC93.8(A7) ; also sheet 6
AC7: IC85.7(QD) IC88.9(A8) IC91.17(P7) IC93.9(A8) ; also sheet 6
AC8: IC86.3(QA) IC89.2(A1) IC90.2(P0) IC94.2(A1) ; also sheet 6
AC9: IC86.2(QB) IC89.3(A2) IC90.4(P1) IC94.3(A2) ; also sheet 6
AC10: IC86.6(QC) IC89.4(A3) IC90.6(P2) IC94.4(A3) ; also sheet 6
AC11: IC86.7(QD) IC89.5(A4) IC90.8(P3) IC94.5(A4) ; also sheet 6
AC12: IC87.3(QA) IC89.6(A5) IC90.11(P4) IC94.6(A5) ; also sheet 6
AC13: IC87.2(QB) IC89.7(A6) IC90.13(P5) IC94.7(A6) ; also sheet 6
AC14: IC87.6(QC) IC89.8(A7) IC90.15(P6) IC94.8(A7) ; also sheet 6
AC15: IC87.7(QD) IC89.9(A8) IC90.17(P7) IC94.9(A8) X1.P$1 ; also sheet 6
BAC0: IC93.18(Y1) J2.1
BAC1: IC93.17(Y2) J2.2
BAC2: IC93.16(Y3) J2.3
BAC3: IC93.15(Y4) J2.4
BAC4: IC93.14(Y5) J2.5
BAC5: IC93.13(Y6) J2.6
BAC6: IC93.12(Y7) J2.7
BAC7: IC93.11(Y8) J2.8
BAC8: IC94.18(Y1) J2.9
BAC9: IC94.17(Y2) J2.10
BAC10: IC94.16(Y3) J2.11
BAC11: IC94.15(Y4) J2.12
BAC12: IC94.14(Y5) J2.13
BAC13: IC94.13(Y6) J2.14
BAC14: IC94.12(Y7) J2.15
BAC15: IC94.11(Y8) J2.16
FNEG: X1.P$2 ; also sheet 6
FZERO: IC66.12(F:O) ; also sheet 6
GND [low power]: C91.1 C92.1 C93.1 C94.1 C95.1 C96.1 C97.1 C98.1 C99.1 C100.1 C101.2 IC75.15(B:G) IC90.1(G) IC90.3(Q0) IC90.5(Q1) IC90.7(Q2) IC90.9(Q3) IC90.12(Q4) IC90.14(Q5) IC90.16(Q6) IC90.18(Q7) IC91.3(Q0) IC91.5(Q1) IC91.7(Q2) IC91.9(Q3) IC91.12(Q4) IC91.14(Q5) IC91.16(Q6) IC91.18(Q7) IC93.1(G1) IC93.19(G2) IC94.1(G1) IC94.19(G2) ; also sheet 2,3,4,6
IBUS0: IC84.15(A) IC88.18(Y1) ; also sheet 2,3,4,6
IBUS1: IC84.1(B) IC88.17(Y2) ; also sheet 2,3,4,6
IBUS2: IC84.10(C) IC88.16(Y3) ; also sheet 2,3,4,6
IBUS3: IC84.9(D) IC88.15(Y4) ; also sheet 2,3,4,6
IBUS4: IC85.15(A) IC88.14(Y5) ; also sheet 2,3,4,6
IBUS5: IC85.1(B) IC88.13(Y6) ; also sheet 2,3,4,6
IBUS6: IC85.10(C) IC88.12(Y7) ; also sheet 2,3,4,6
IBUS7: IC85.9(D) IC88.11(Y8) ; also sheet 2,3,4,6
IBUS8: IC86.15(A) IC89.18(Y1) ; also sheet 2,3,4,6
IBUS9: IC86.1(B) IC89.17(Y2) ; also sheet 2,3,4,6
IBUS10: IC86.10(C) IC89.16(Y3) ; also sheet 2,3,4,6
IBUS11: IC86.9(D) IC89.15(Y4) ; also sheet 2,3,4,6
IBUS12: IC87.15(A) IC89.14(Y5) ; also sheet 2,3,4,6
IBUS13: IC87.1(B) IC89.13(Y6) ; also sheet 2,3,4,6
IBUS14: IC87.10(C) IC89.12(Y7) ; also sheet 2,3,4,6
IBUS15: IC87.9(D) IC89.11(Y8) ; also sheet 2,3,4,6
N$793: IC90.19(P=Q) IC91.1(G)
RESET: IC84.14(CLEAR) IC85.14(CLEAR) IC86.14(CLEAR) IC87.14(CLEAR) ; also sheet 3,4
VCC [low power]: C91.2 C92.2 C93.2 C94.2 C95.2 C96.2 C97.2 C98.2 C99.2 C100.2 C101.1 ; also sheet 2,3,4,6
Unconnected: IC75.9(B:Y3) IC75.10(B:Y2)

### Buses
IBUS[0..15]
AC[0..15]

### Notes on the sheet
- Tri-State Buffering
- Register & Increment
- Front Panel Buffers & Connectors
- Zero Flag
- !DECAC! reserved for future expansion
- Asynchronous toggles of L
- Decoupling
- NC
- U

## Sheet 6 of 6
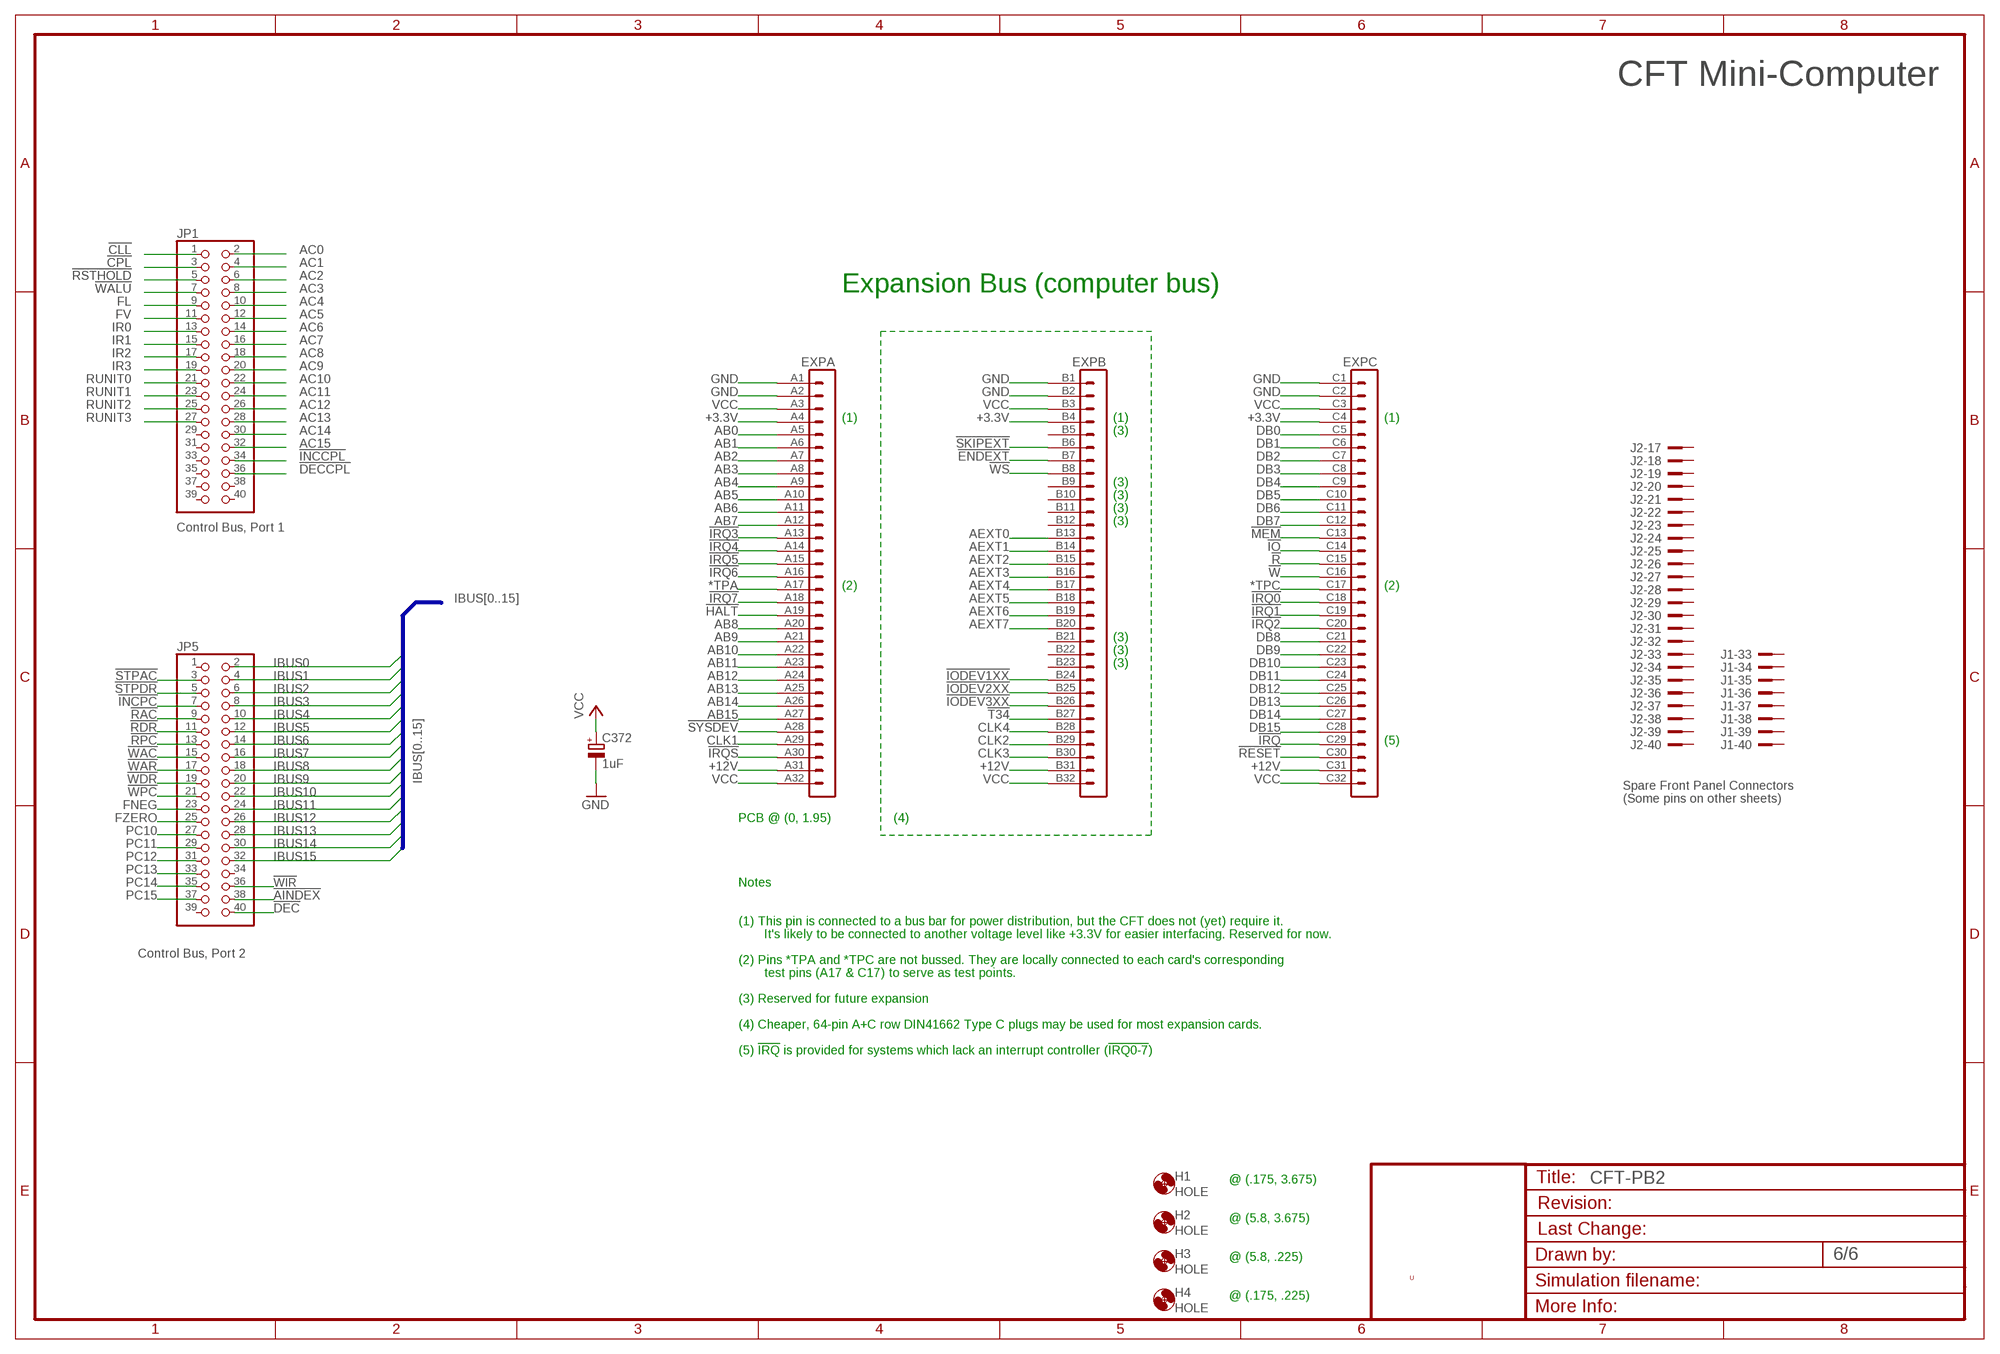
[diagram p5: schematic, sheet 6]

### Parts
C372  1uF  CPOL-EUE2.5-5  [E2,5-5]
EXP  VG96-3K  [VG96K]
H1  HOLE  [STANDOFF_28_60]
H2  HOLE  [STANDOFF_28_60]
H3  HOLE  [STANDOFF_28_60]
H4  HOLE  [STANDOFF_28_60]
JP1  PINHD-2X20  [2X20]
JP5  PINHD-2X20  [2X20]

### Nets
!AINDEX: JP5.38 ; also sheet 2
!CLL: JP1.1
!CPL: JP1.3
!DEC: JP5.40 ; also sheet 4,5
!DECCPL: JP1.36 ; also sheet 5
!ENDEXT: EXP.B7
!HALT: EXP.A19
!INCCPL: JP1.34 ; also sheet 5
!INCPC: JP5.7 ; also sheet 3
!IO: EXP.C14 ; also sheet 2
!IODEV1XX: EXP.B24 ; also sheet 2
!IODEV2XX: EXP.B25 ; also sheet 2
!IODEV3XX: EXP.B26 ; also sheet 2
!IRQ: EXP.C29
!IRQ0: EXP.C18
!IRQ1: EXP.C19
!IRQ2: EXP.C20
!IRQ3: EXP.A13
!IRQ4: EXP.A14
!IRQ5: EXP.A15
!IRQ6: EXP.A16
!IRQ7: EXP.A18
!IRQS: EXP.A30
!MEM: EXP.C13 ; also sheet 2
!R: EXP.C15
!RAC: JP5.9 ; also sheet 5
!RDR: JP5.11 ; also sheet 4
!RESET: EXP.C30 ; also sheet 2,3
!RPC: JP5.13 ; also sheet 3
!RSTHOLD: JP1.5
!SKIPEXT: EXP.B6
!STPAC: JP5.3 ; also sheet 5
!STPDR: JP5.5 ; also sheet 4
!SYSDEV: EXP.A28 ; also sheet 2
!T34: EXP.B27
!W: EXP.C16
!WAC: JP5.15 ; also sheet 5
!WALU: JP1.7
!WAR: JP5.17 ; also sheet 2
!WDR: JP5.19 ; also sheet 4
!WIR: JP5.36 ; also sheet 2
!WPC: JP5.21 ; also sheet 3
!WS: EXP.B8
*TPA: EXP.A17
*TPC: EXP.C17
+3.3V: EXP.A4 EXP.B4 EXP.C4
+12V [LED power]: EXP.A31 EXP.B31 EXP.C31
AB0: EXP.A5 ; also sheet 2
AB1: EXP.A6 ; also sheet 2
AB2: EXP.A7 ; also sheet 2
AB3: EXP.A8 ; also sheet 2
AB4: EXP.A9 ; also sheet 2
AB5: EXP.A10 ; also sheet 2
AB6: EXP.A11 ; also sheet 2
AB7: EXP.A12 ; also sheet 2
AB8: EXP.A20 ; also sheet 2
AB9: EXP.A21 ; also sheet 2
AB10: EXP.A22 ; also sheet 2
AB11: EXP.A23 ; also sheet 2
AB12: EXP.A24 ; also sheet 2
AB13: EXP.A25 ; also sheet 2
AB14: EXP.A26 ; also sheet 2
AB15: EXP.A27 ; also sheet 2
AC0: JP1.2 ; also sheet 5
AC1: JP1.4 ; also sheet 5
AC2: JP1.6 ; also sheet 5
AC3: JP1.8 ; also sheet 5
AC4: JP1.10 ; also sheet 5
AC5: JP1.12 ; also sheet 5
AC6: JP1.14 ; also sheet 5
AC7: JP1.16 ; also sheet 5
AC8: JP1.18 ; also sheet 5
AC9: JP1.20 ; also sheet 5
AC10: JP1.22 ; also sheet 5
AC11: JP1.24 ; also sheet 5
AC12: JP1.26 ; also sheet 5
AC13: JP1.28 ; also sheet 5
AC14: JP1.30 ; also sheet 5
AC15: JP1.32 ; also sheet 5
AEXT0: EXP.B13
AEXT1: EXP.B14
AEXT2: EXP.B15
AEXT3: EXP.B16
AEXT4: EXP.B17
AEXT5: EXP.B18
AEXT6: EXP.B19
AEXT7: EXP.B20
CLK1: EXP.A29
CLK2: EXP.B29
CLK3: EXP.B30
CLK4: EXP.B28
DB0: EXP.C5
DB1: EXP.C6
DB2: EXP.C7
DB3: EXP.C8
DB4: EXP.C9
DB5: EXP.C10
DB6: EXP.C11
DB7: EXP.C12
DB8: EXP.C21
DB9: EXP.C22
DB10: EXP.C23
DB11: EXP.C24
DB12: EXP.C25
DB13: EXP.C26
DB14: EXP.C27
DB15: EXP.C28
FL: JP1.9
FNEG: JP5.23 ; also sheet 5
FV: JP1.11
FZERO: JP5.25 ; also sheet 5
GND [low power]: C372.- EXP.A1 EXP.A2 EXP.B1 EXP.B2 EXP.C1 EXP.C2 ; also sheet 2,3,4,5
IBUS0: JP5.2 ; also sheet 2,3,4,5
IBUS1: JP5.4 ; also sheet 2,3,4,5
IBUS2: JP5.6 ; also sheet 2,3,4,5
IBUS3: JP5.8 ; also sheet 2,3,4,5
IBUS4: JP5.10 ; also sheet 2,3,4,5
IBUS5: JP5.12 ; also sheet 2,3,4,5
IBUS6: JP5.14 ; also sheet 2,3,4,5
IBUS7: JP5.16 ; also sheet 2,3,4,5
IBUS8: JP5.18 ; also sheet 2,3,4,5
IBUS9: JP5.20 ; also sheet 2,3,4,5
IBUS10: JP5.22 ; also sheet 2,3,4,5
IBUS11: JP5.24 ; also sheet 2,3,4,5
IBUS12: JP5.26 ; also sheet 2,3,4,5
IBUS13: JP5.28 ; also sheet 2,3,4,5
IBUS14: JP5.30 ; also sheet 2,3,4,5
IBUS15: JP5.32 ; also sheet 2,3,4,5
IR0: JP1.13
IR1: JP1.15
IR2: JP1.17
IR3: JP1.19
PC10: JP5.27 ; also sheet 3
PC11: JP5.29 ; also sheet 3
PC12: JP5.31 ; also sheet 3
PC13: JP5.33 ; also sheet 3
PC14: JP5.35 ; also sheet 3
PC15: JP5.37 ; also sheet 3
RUNIT0: JP1.21
RUNIT1: JP1.23
RUNIT2: JP1.25
RUNIT3: JP1.27
VCC [low power]: C372.+ EXP.A3 EXP.A32 EXP.B3 EXP.B32 EXP.C3 EXP.C32 ; also sheet 2,3,4,5
Unconnected: EXP.B5 EXP.B9 EXP.B10 EXP.B11 EXP.B12 EXP.B21 EXP.B22 EXP.B23 J1.33 J1.34 J1.35 J1.36 J1.37 J1.38 J1.39 J1.40 J2.17 J2.18 J2.19 J2.20 J2.21 J2.22 J2.23 J2.24 J2.25 J2.26 J2.27 J2.28 J2.29 J2.30 J2.31 J2.32 J2.33 J2.34 J2.35 J2.36 J2.37 J2.38 J2.39 J2.40 JP1.29 JP1.31 JP1.33 JP1.35 JP1.37 JP1.38 JP1.39 JP1.40 JP5.1 JP5.34 JP5.39

### Buses
IBUS[0..15]

### Notes on the sheet
- CFT Mini-Computer
- Expansion Bus (computer bus)
- (1) | (1) | (1)
- (3)
- (3)
- (3)
- (3)
- (3)
- Control Bus, Port 1
- (2) | (2)
- (3)
- (3)
- (3)
- (5)
- Spare Front Panel Connectors
- (Some pins on other sheets)
- PCB @ (0, 1.95) | (4)
- Notes
- (1) This pin is connected to a bus bar for power distribution, but the CFT does not (yet) require it.
- It's likely to be connected to another voltage level like +3.3V for easier interfacing. Reserved for now.
- Control Bus, Port 2
- (2) Pins *TPA and *TPC are not bussed. They are locally connected to each card's corresponding
- test pins (A17 & C17) to serve as test points.
- (3) Reserved for future expansion
- (4) Cheaper, 64-pin A+C row DIN41662 Type C plugs may be used for most expansion cards.
- (5) !IRQ! is provided for systems which lack an interrupt controller (!IRQ0-7!)
- @ (.175, 3.675)
- @ (5.8, 3.675)
- @ (5.8, .225)
- U
- @ (.175, .225)

## Power pins joined to a net without a drawn wire
GND: IC55.7(P:GND) IC56.10(GND) IC57.10(GND) IC58.10(GND) IC59.10(GND) IC60.8(GND) IC63.7(P:GND) IC64.10(GND) IC65.8(GND) IC66.7(P:GND) IC67.8(GND) IC68.8(GND) IC69.8(GND) IC70.8(GND) IC71.10(GND) IC72.10(GND) IC73.10(GND) IC74.10(GND) IC75.8(P:GND) IC76.8(GND) IC77.8(GND) IC78.8(GND) IC79.8(GND) IC80.10(GND) IC81.10(GND) IC82.10(GND) IC83.10(GND) IC84.8(GND) IC85.8(GND) IC86.8(GND) IC87.8(GND) IC88.10(GND) IC89.10(GND) IC90.10(GND) IC91.10(GND) IC93.10(GND) IC94.10(GND)
VCC: IC55.14(P:VCC) IC56.20(VCC) IC57.20(VCC) IC58.20(VCC) IC59.20(VCC) IC60.16(VCC) IC63.14(P:VCC) IC64.20(VCC) IC65.16(VCC) IC66.14(P:VCC) IC67.16(VCC) IC68.16(VCC) IC69.16(VCC) IC70.16(VCC) IC71.20(VCC) IC72.20(VCC) IC73.20(VCC) IC74.20(VCC) IC75.16(P:VCC) IC76.16(VCC) IC77.16(VCC) IC78.16(VCC) IC79.16(VCC) IC80.20(VCC) IC81.20(VCC) IC82.20(VCC) IC83.20(VCC) IC84.16(VCC) IC85.16(VCC) IC86.16(VCC) IC87.16(VCC) IC88.20(VCC) IC89.20(VCC) IC90.20(VCC) IC91.20(VCC) IC93.20(VCC) IC94.20(VCC)

## Library data of the parts
C63-C70 C72-C101 = rcl:C-EU: CAPACITOR, European symbol
C372 = rcl:CPOL-EU: POLARIZED CAPACITOR, European symbol
EXP = alexios-19inch:VG96-3: PCB EUROCARD, 96-pin type C/ABC, 2.54 mm
H1-H4 = alexios:HOLE: Hole for a standoff or mount. Hole diameter: 3.3mm. External Diameter: 6mm.
IC55 = alexios:74*08: Quad 2-input AND gate
IC56 IC57 = alexios:74*574: 8-bit D type FLIP FLOP bus driver
IC58 IC59 IC71-IC74 IC80-IC83 IC88 IC89 IC93 IC94 = alexios:74*541: Octal BUFFER and LINE DRIVER, 3-state
IC60 IC65 = alexios:74*138: 3-line to 8-line DECODER/DEMULTIPLEXER
IC63 = alexios:74*74: Dual D type positive edge triggered FLIP FLOP, preset and clear
IC64 IC90 IC91 = alexios:74*688: 8-bit MAGNITUDE/IDENTITY COMPARATOR, totem pole
IC66 = alexios:74*04: Hex INVERTER
IC67-IC70 IC76-IC79 IC84-IC87 = alexios:74*193: Presettable Synchronous Binary Up/Down Counter Up/down 4-bit binary counter with load and clear inputs, and borrow and carry outputs. Farnell description: <http://uk.farnell.com/nxp/74hct193n/ic-74hct-cmos-74hct193-dip16-5v/dp/382218> Order Code: 382218 Manufacturer Part No: 74HCT193N RoHS : Yes Description: IC, 74HCT CMOS, 74HCT193, DIP16, 5V Counter Type:Binary Clock Frequency:47MHz Count Maximum:15 Supply Voltage Range:4.5V to 5.5V Logic Case Style:DIP No. of Pins:16 Operating Temperature Range:-40°C to +125°C Base Number:74 Clock Frequency Max:43MHz Count Max:16 Counter Measuring Functions:Presettable Synchronous Binary Up / Down Counter Device Marking:74HCT193 IC Generic Number:74HCT193 Logic Function Number:193 Logic IC Base Number:74193 Logic IC Family:HCT Logic IC Function:Presettable Synchronous 4bit Binary Up/Down Counter No. of Gates:1 No. of Inputs:4 Operating Temperature Max:125°C Operating Temperature Min:-40°C Package / Case:DIP Supply Voltage:5V Supply Voltage Max:5.5V Supply Voltage Min:4.5V Termination Type:Through Hole
IC75 = alexios:74*139: Dual 2-line to 4-line DECODER/DEMULTIPLEXER
J1 J2 = con-3m:2540-: 3M (TM) Pak 100 4-Wall Header Source: 3M; OC_FARNELL: 9838414; OC_NEWARK: unknown
JP1 JP5 = pinhead:PINHD-2X20: PIN HEADER
X1 = alexios:SIGNAL-RENAME: Connect two signals of different names.

## Net classes
0 default: width 0.305 mm, clearance 0.203 mm
1 low power: width 1.27 mm, clearance 0.254 mm
2 LED power: width 1.93 mm, clearance 0.254 mm